# EAGLE design TikiLights (EAGLE 7.3.0)
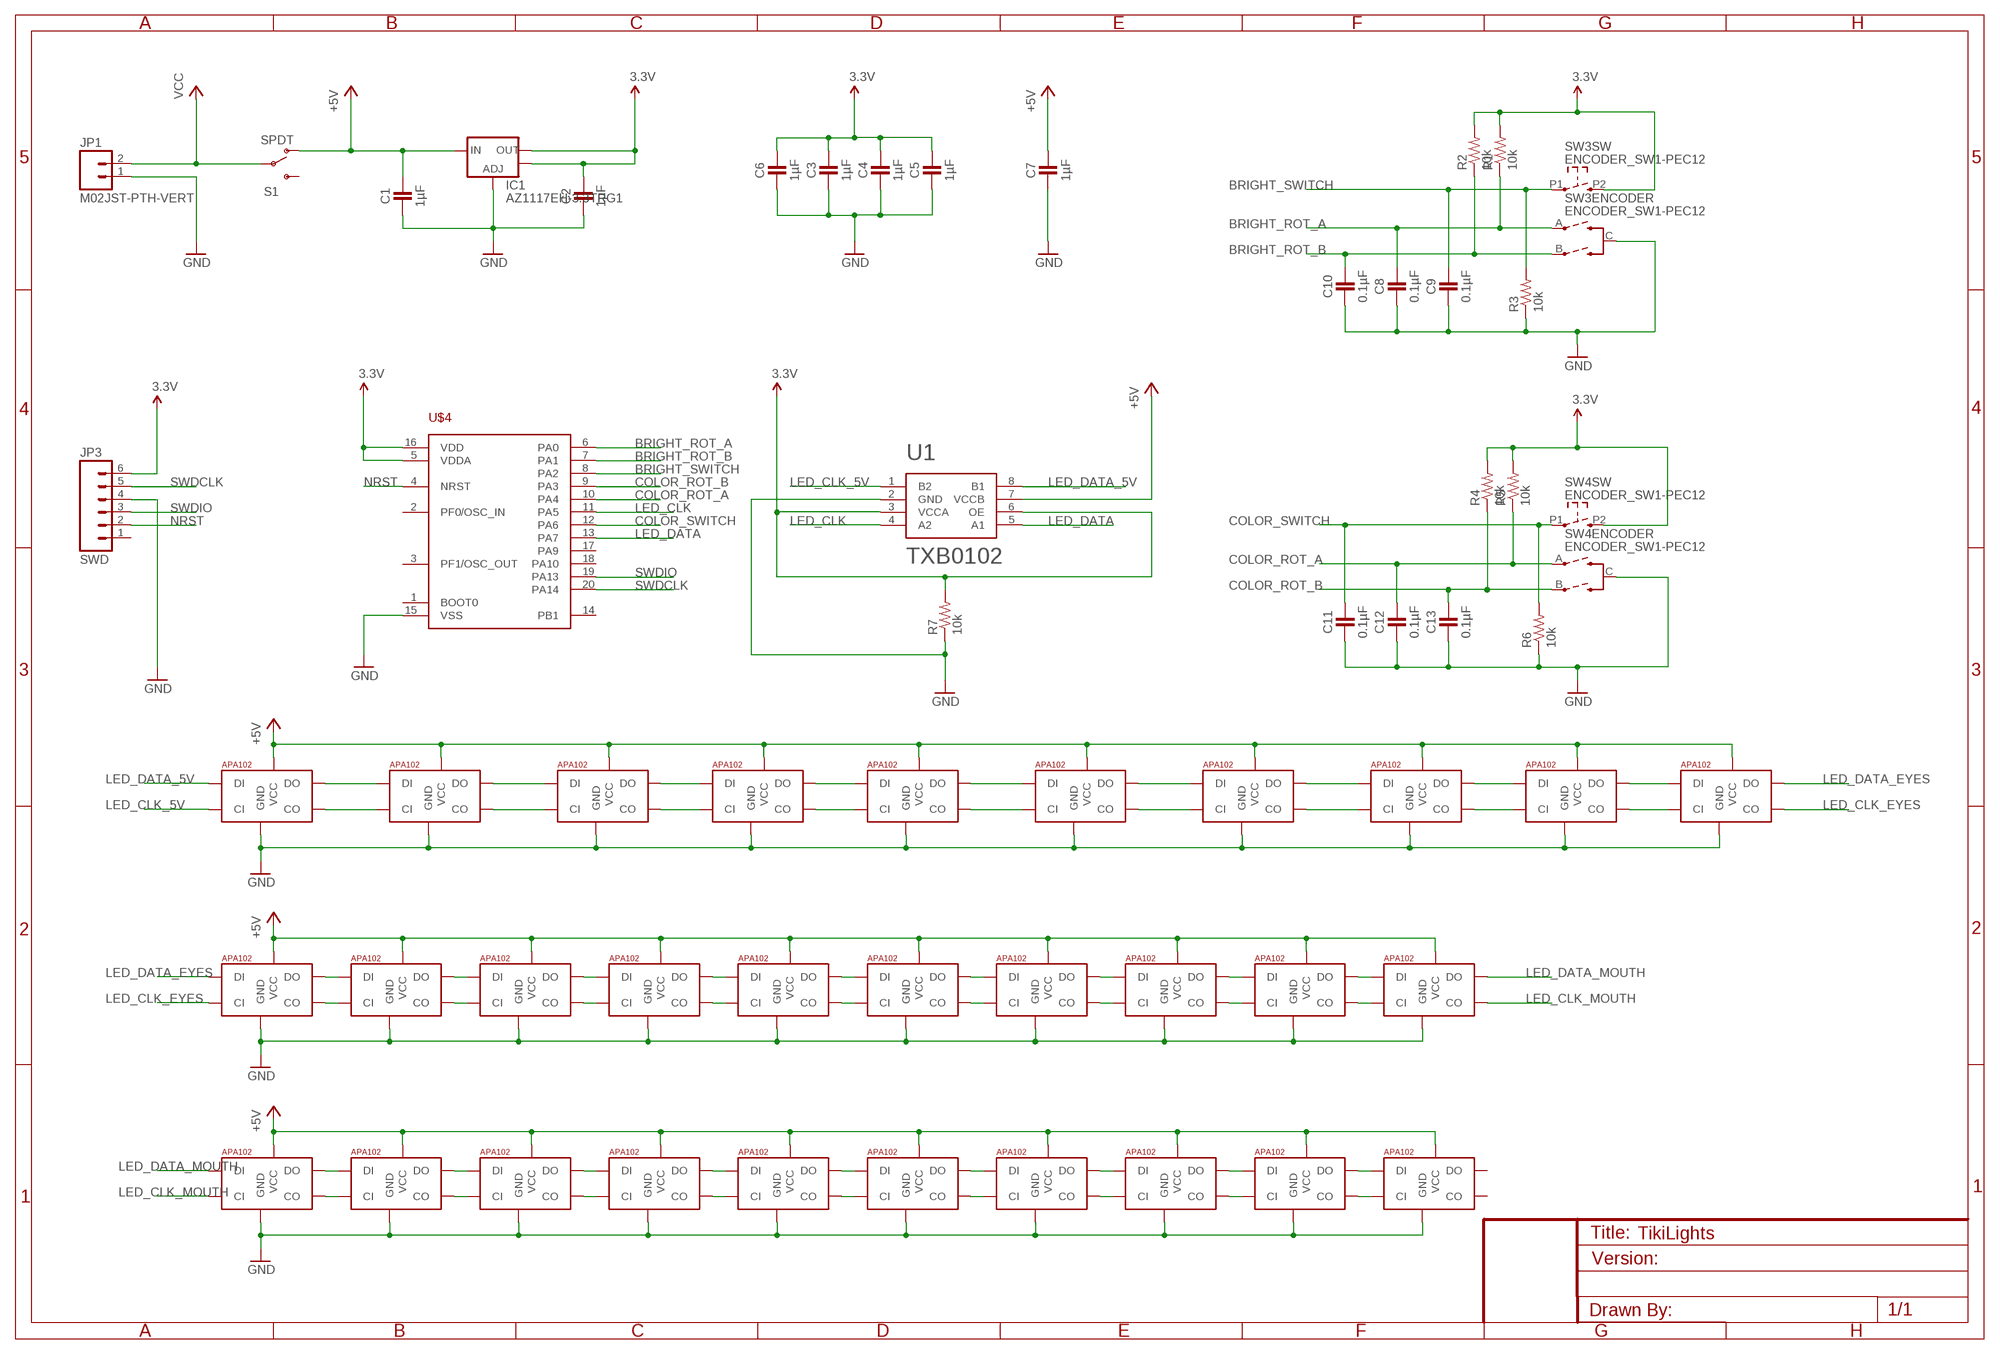
[diagram p0: schematic, sheet 1]

## Parts
C1  1µF  CAPACITOR0603_CAP  [0603_CAP]
C2  1µF  CAPACITOR0603_CAP  [0603_CAP]
C3  1µF  CAPACITOR0603_CAP  [0603_CAP]
C4  1µF  CAPACITOR0603_CAP  [0603_CAP]
C5  1µF  CAPACITOR0603_CAP  [0603_CAP]
C6  1µF  CAPACITOR0603_CAP  [0603_CAP]
C7  1µF  CAPACITOR0603_CAP  [0603_CAP]
C8  0.1µF  CAPACITOR0603_CAP  [0603_CAP]
C9  0.1µF  CAPACITOR0603_CAP  [0603_CAP]
C10  0.1µF  CAPACITOR0603_CAP  [0603_CAP]
C11  0.1µF  CAPACITOR0603_CAP  [0603_CAP]
C12  0.1µF  CAPACITOR0603_CAP  [0603_CAP]
C13  0.1µF  CAPACITOR0603_CAP  [0603_CAP]
IC1  AZ1117EH-3.3TRG1  V_REG_LM1117SOT223  [SOT223]
JP1  M02JST-PTH-VERT  [JST-2-PTH-VERT]
JP3  SWD  M06POLAR  [MOLEX-1X6]
R1  10k  RESISTOR0603  [0603-RES]
R2  10k  RESISTOR0603  [0603-RES]
R3  10k  RESISTOR0603  [0603-RES]
R4  10k  RESISTOR0603  [0603-RES]
R5  10k  RESISTOR0603  [0603-RES]
R6  10k  RESISTOR0603  [0603-RES]
R7  10k  RESISTOR0603  [0603-RES]
S1  SPDT  SWITCH-SPDTPTH  [SWITCH-SPDT]
SW3  ENCODER_SW1-PEC12  [PEC12_INCREMENTAL_ENCODER]
SW4  ENCODER_SW1-PEC12  [PEC12_INCREMENTAL_ENCODER]
U1  TXB0102  [SOP50P310X90-8N]
U$1  APA1022020  [APA102_2020]
U$2  APA1022020  [APA102_2020]
U$3  APA1022020  [APA102_2020]
U$4  STM32F030F4  [TSSOP20]
U$5  APA1022020  [APA102_2020]
U$6  APA1022020  [APA102_2020]
U$7  APA1025050  [APA102_5050]
U$8  APA1025050  [APA102_5050]
U$9  APA1025050  [APA102_5050]
U$10  APA1025050  [APA102_5050]
U$11  APA1025050  [APA102_5050]
U$12  APA1025050  [APA102_5050]
U$13  APA1025050  [APA102_5050]
U$14  APA1025050  [APA102_5050]
U$15  APA1025050  [APA102_5050]
U$16  APA1025050  [APA102_5050]
U$17  APA1025050  [APA102_5050]
U$18  APA1025050  [APA102_5050]
U$19  APA1025050  [APA102_5050]
U$20  APA1025050  [APA102_5050]
U$21  APA1025050  [APA102_5050]
U$22  APA1025050  [APA102_5050]
U$23  APA1025050  [APA102_5050]
U$24  APA1025050  [APA102_5050]
U$25  APA1025050  [APA102_5050]
U$26  APA1025050  [APA102_5050]
U$27  APA1022020  [APA102_2020]
U$28  APA1022020  [APA102_2020]
U$29  APA1022020  [APA102_2020]
U$30  APA1022020  [APA102_2020]
U$31  APA1022020  [APA102_2020]

## Nets
3.3V: C2.1 C3.1 C4.1 C5.1 C6.1 IC1.2(OUT) IC1.4(OUT) JP3.6 R1.2 R2.2 R4.2 R5.2 R7.2 SW3.P2 SW4.P2 U1.3(VCCA) U1.6(OE) U$4.5(VDDA) U$4.16(VDD)
+5V: C1.1 C7.1 IC1.3(IN) S1.1(O) U1.7(VCCB) U$1.V_CC(VCC) U$2.V_CC(VCC) U$3.V_CC(VCC) U$5.V_CC(VCC) U$6.V_CC(VCC) U$7.1(VCC) U$8.1(VCC) U$9.1(VCC) U$10.1(VCC) U$11.1(VCC) U$12.1(VCC) U$13.1(VCC) U$14.1(VCC) U$15.1(VCC) U$16.1(VCC) U$17.1(VCC) U$18.1(VCC) U$19.1(VCC) U$20.1(VCC) U$21.1(VCC) U$22.1(VCC) U$23.1(VCC) U$24.1(VCC) U$25.1(VCC) U$26.1(VCC) U$27.V_CC(VCC) U$28.V_CC(VCC) U$29.V_CC(VCC) U$30.V_CC(VCC) U$31.V_CC(VCC)
BRIGHT_ROT_A: C8.1 R1.1 SW3.A(ENCODER:A) U$4.6(PA0)
BRIGHT_ROT_B: C10.1 R2.1 SW3.B(ENCODER:B) U$4.7(PA1)
BRIGHT_SWITCH: C9.1 R3.2 SW3.P1 U$4.8(PA2)
COLOR_ROT_A: C12.1 R5.1 SW4.A(ENCODER:A) U$4.10(PA4)
COLOR_ROT_B: C13.1 R4.1 SW4.B(ENCODER:B) U$4.9(PA3)
COLOR_SWITCH: C11.1 R6.2 SW4.P1 U$4.12(PA6)
GND: C1.2 C2.2 C3.2 C4.2 C5.2 C6.2 C7.2 C8.2 C9.2 C10.2 C11.2 C12.2 C13.2 IC1.1(ADJ) JP1.1 JP3.4 R3.1 R6.1 R7.1 SW3.C(ENCODER:C) SW4.C(ENCODER:C) U1.2(GND) U$1.GND U$2.GND U$3.GND U$4.15(VSS) U$5.GND U$6.GND U$7.6(GND) U$8.6(GND) U$9.6(GND) U$10.6(GND) U$11.6(GND) U$12.6(GND) U$13.6(GND) U$14.6(GND) U$15.6(GND) U$16.6(GND) U$17.6(GND) U$18.6(GND) U$19.6(GND) U$20.6(GND) U$21.6(GND) U$22.6(GND) U$23.6(GND) U$24.6(GND) U$25.6(GND) U$26.6(GND) U$27.GND U$28.GND U$29.GND U$30.GND U$31.GND
LED_CLK: U1.4(A2) U$4.11(PA5)
LED_CLK_5V: U1.1(B2) U$1.C_IN(CI)
LED_CLK_EYES: U$7.5(CI) U$31.CL_OUT(CO)
LED_CLK_MOUTH: U$16.2(CO) U$17.5(CI)
LED_DATA: U1.5(A1) U$4.13(PA7)
LED_DATA_5V: U1.8(B1) U$1.D_IN(DI)
LED_DATA_EYES: U$7.4(DI) U$31.D_OUT(DO)
LED_DATA_MOUTH: U$16.3(DO) U$17.4(DI)
N$7: U$1.D_OUT(DO) U$2.D_IN(DI)
N$9: U$1.CL_OUT(CO) U$2.C_IN(CI)
N$14: U$2.D_OUT(DO) U$3.D_IN(DI)
N$15: U$2.CL_OUT(CO) U$3.C_IN(CI)
N$16: U$3.D_OUT(DO) U$5.D_IN(DI)
N$17: U$3.CL_OUT(CO) U$5.C_IN(CI)
N$18: U$5.D_OUT(DO) U$6.D_IN(DI)
N$19: U$5.CL_OUT(CO) U$6.C_IN(CI)
N$20: U$6.D_OUT(DO) U$27.D_IN(DI)
N$21: U$6.CL_OUT(CO) U$27.C_IN(CI)
N$22: U$27.D_OUT(DO) U$28.D_IN(DI)
N$23: U$27.CL_OUT(CO) U$28.C_IN(CI)
N$24: U$28.D_OUT(DO) U$29.D_IN(DI)
N$25: U$28.CL_OUT(CO) U$29.C_IN(CI)
N$26: U$29.D_OUT(DO) U$30.D_IN(DI)
N$27: U$29.CL_OUT(CO) U$30.C_IN(CI)
N$28: U$30.D_OUT(DO) U$31.D_IN(DI)
N$29: U$30.CL_OUT(CO) U$31.C_IN(CI)
N$34: U$7.2(CO) U$8.5(CI)
N$35: U$7.3(DO) U$8.4(DI)
N$36: U$8.3(DO) U$9.4(DI)
N$37: U$8.2(CO) U$9.5(CI)
N$38: U$9.3(DO) U$10.4(DI)
N$39: U$9.2(CO) U$10.5(CI)
N$40: U$10.3(DO) U$11.4(DI)
N$41: U$10.2(CO) U$11.5(CI)
N$42: U$11.3(DO) U$12.4(DI)
N$43: U$11.2(CO) U$12.5(CI)
N$44: U$12.3(DO) U$13.4(DI)
N$45: U$12.2(CO) U$13.5(CI)
N$46: U$13.3(DO) U$14.4(DI)
N$47: U$13.2(CO) U$14.5(CI)
N$48: U$14.3(DO) U$15.4(DI)
N$49: U$14.2(CO) U$15.5(CI)
N$50: U$15.2(CO) U$16.5(CI)
N$51: U$15.3(DO) U$16.4(DI)
N$56: U$17.3(DO) U$18.4(DI)
N$57: U$17.2(CO) U$18.5(CI)
N$58: U$18.3(DO) U$19.4(DI)
N$59: U$18.2(CO) U$19.5(CI)
N$60: U$19.3(DO) U$20.4(DI)
N$61: U$19.2(CO) U$20.5(CI)
N$62: U$20.3(DO) U$21.4(DI)
N$63: U$20.2(CO) U$21.5(CI)
N$64: U$21.3(DO) U$22.4(DI)
N$65: U$21.2(CO) U$22.5(CI)
N$66: U$22.3(DO) U$23.4(DI)
N$67: U$22.2(CO) U$23.5(CI)
N$68: U$23.3(DO) U$24.4(DI)
N$69: U$23.2(CO) U$24.5(CI)
N$70: U$24.3(DO) U$25.4(DI)
N$71: U$24.2(CO) U$25.5(CI)
N$72: U$25.3(DO) U$26.4(DI)
N$73: U$25.2(CO) U$26.5(CI)
NRST: JP3.2 U$4.4(NRST)
SWDCLK: JP3.5 U$4.20(PA14)
SWDIO: JP3.3 U$4.19(PA13)
VCC: JP1.2 S1.2(P)
Unconnected: JP3.1 S1.3(S) U$4.1(BOOT0) U$4.2(PF0/OSC_IN) U$4.3(PF1/OSC_OUT) U$4.14(PB1) U$4.17(PA9) U$4.18(PA10) U$26.2(CO) U$26.3(DO)

## Library data of the parts
C1-C13 = passives:CAPACITOR: 0402 Capacitor
IC1 = SparkFun-PowerIC:V_REG_LM1117: Voltage Regulator LM1117 Standard adjustable voltage regulator but in SMD form. Spark Fun Electronics SKU : COM-00595
JP1 = SparkFun-Connectors:M02: Standard 2-pin 0.1" header. Use with - straight break away headers ( PRT-00116) - right angle break away headers (PRT-00553) - swiss pins (PRT-00743) - machine pins (PRT-00117) - female headers (PRT-00115) Molex polarized connector foot print use with: PRT-08233 with associated crimp pins and housings. 2.54_SCREWTERM for use with PRT-10571. 3.5mm Screw Terminal footprints for PRT-08084 5mm Screw Terminal footprints for use with PRT-08433
JP3 = SparkFun-Connectors:M06: Header 6 Standard 6-pin 0.1" header. Use with straight break away headers (SKU : PRT-00116), right angle break away headers (PRT-00553), swiss pins (PRT-00743), machine pins (PRT-00117), and female headers (PRT-00115). Molex polarized connector foot print use with SKU : PRT-08094 with associated crimp pins and housings. NOTES ON THE VARIANTS LOCK and LOCK_LONGPADS... This footprint was designed to help hold the alignment of a through-hole component (i.e. 6-pin header) while soldering it into place. You may notice that each hole has been shifted either up or down by 0.005 of an inch from it's more standard position (which is a perfectly straight line). This slight alteration caused the pins (the squares in the middle) to touch the edges of the holes. Because they are alternating, it causes a "brace" to hold the component in place. 0.005 has proven to be the perfect amount of "off-center" position when using our standard breakaway headers. Although looks a little odd when you look at the bare footprint, once you have a header in there, the alteration is very hard to notice. Also,if you push a header all the way into place, it is covered up entirely on the bottom side. This idea of altering the position of holes to aid alignment will be further integrated into the Sparkfun Library for other footprints. It can help hold any component with 3 or more connection pins.
R1-R7 = SparkFun-Resistors:RESISTOR: Resistor Basic schematic elements and footprints for 0603, 1206, and PTH resistors.
S1 = SparkFun-Electromechanical:SWITCH-SPDT: SPDT Switch Simple slide switch, Spark Fun Electronics SKU : COM-00102 DPDT SMT slide switch, AYZ0202, SWCH-08179
SW3 SW4 = dp_devices.v6:ENCODER_SW1: Incremental Encoder with push switch
U1 = TXB0102:TXB0102; AVAILABILITY: Unavailable; DESCRIPTION: 2-Bit Bidirectional Voltage-Level Translator with Auto Direction Sensing and +/-15-kV ESD Protect; MF: Texas Instruments; MP: TXB0102; PACKAGE: None; PRICE: None
U$1-U$3 U$5-U$31 = jos-ph:APA102: APA102C 5050 RGB LED -- Adafruit DotStar Single LED Pixel Product Page: https://www.adafruit.com/products/2343 Datasheet: https://cdn-shop.adafruit.com/product-files/2343/APA102C.pdf
U$4 = stm32f030f4:STM32F030F4

## Board
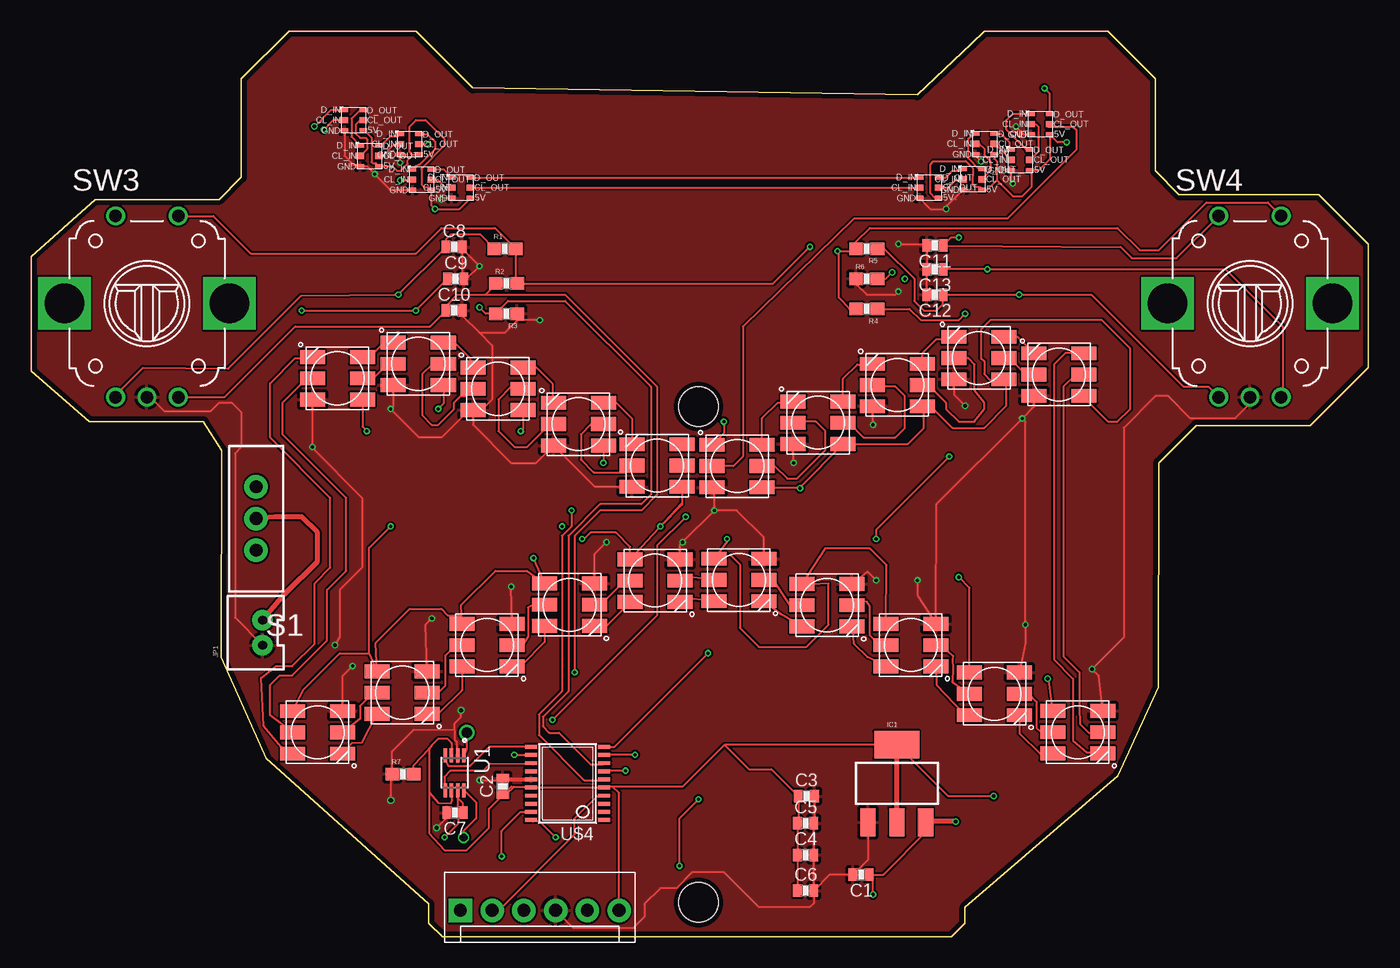
[diagram p1: board, top side]
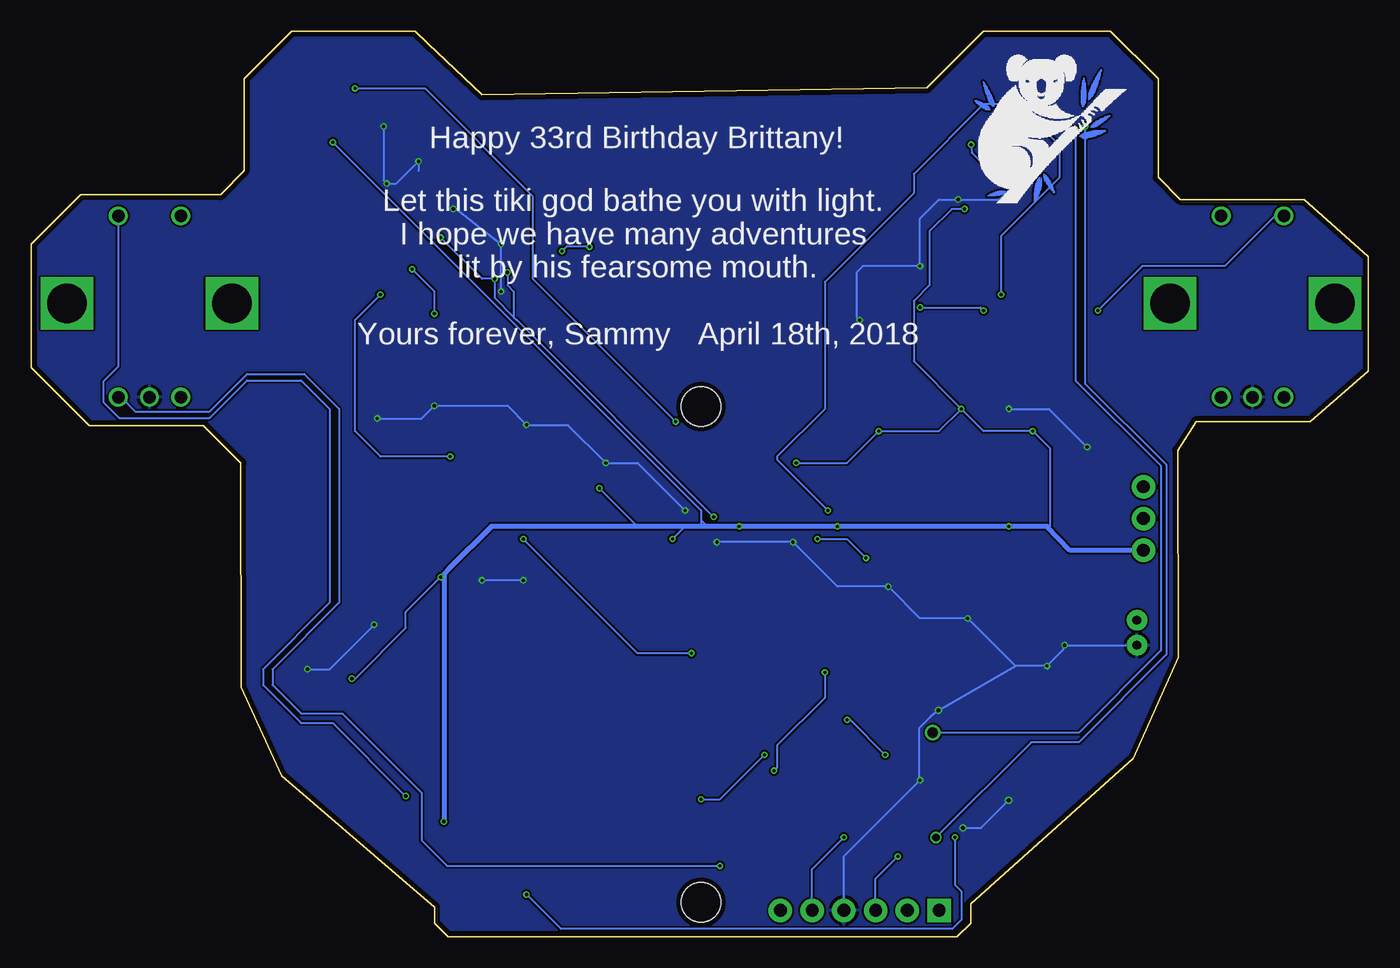
[diagram p2: board, bottom side, seen from below]

Size 106.98 x 72.47 mm. Coordinates in mm from the lower left corner, seen from the top.
Outline: 75.23,71.45 70.89,67.38 35.32,67.93 30.78,72.47 20.62,72.47 16.81,68.66 16.81,60.79 15.04,59.01 5.13,59.01 0,54.44 0,45.29 4.62,41.23 13.77,41.23 15.24,38.92 15.2,22.37 18.79,14.3 31.8,2.62 31.8,1.1 32.9,0 73.63,0 74.73,1.1 74.73,2.37 86.95,12.89 90.2,19.95 90.22,37.93 93.22,40.92 102.36,40.92 106.98,45.55 106.98,55.45 103.02,59.39 91.85,59.39 89.97,61.29 89.97,68.66 86.16,72.47 76.25,72.47 75.23,71.45
Copper layers (1*16): Top 0.035559375mm / dielectric 1.6mm / Bottom 0.035559375mm
Design rules "oshpark-2layer": minimum track width 6mil, minimum drill 10mil, track to track 6mil, track to pad 6mil, pad to pad 6mil, via to via 6mil, smd to smd 6mil, copper to edge 15mil, drill to drill 6mil, minimum pad ring 5mil, minimum via ring 5mil, stop-mask expansion 2.5mil, vias tented up to drill 0mil, thermal gap 10mil
Holes 3.17 mm at 53.39,2.75 53.39,42.43

### Footprints (pad centres in the part's own frame; a part is rotated, then mirrored left to right if it is on the bottom)
0603_CAP = smd 0.7 x 1: 1 -0.65,0; 2 0.65,0
SOT223 = smd 1.219 x 2.235: 1 -2.311,-3.099; 2 0,-3.099; 3 2.311,-3.099 | smd 3.6 x 2.2: 4 0,3.099
JST-2-PTH-VERT = drill 0.7 pad 1.626: 1 -1,-0.55; 2 1,-0.55
MOLEX-1X6 = drill 1.016 pad 1.88 square: 1 0,0 | drill 1.016 pad 1.88: 2 2.54,0; 3 5.08,0; 4 7.62,0; 5 10.16,0; 6 12.7,0
0603-RES = smd 1.1 x 1: 1 -0.85,0; 2 0.85,0
SWITCH-SPDT = drill 1.016 pad 1.88: 1 0,2.54; 2 0,0; 3 0,-2.54
PEC12_INCREMENTAL_ENCODER = drill 1: A -2.5,-7.5; B 2.5,-7.5; C 0,-7.5; P1 -2.5,7; P2 2.5,7 | drill 3.175 square: GND@1 -6.6,0; GND@2 6.6,0
SOP50P310X90-8N = smd 1.12 x 0.27: 1 -1.405,0.75; 2 -1.405,0.25; 3 -1.405,-0.25; 4 -1.405,-0.75; 5 1.405,-0.75; 6 1.405,-0.25; 7 1.405,0.25; 8 1.405,0.75
APA102_2020 = smd 0.6 x 0.5: C_IN 0.25,1; CL_OUT 1.75,1 | smd 0.6 x 0.35: D_IN 0.25,1.825; D_OUT 1.75,1.825; GND 0.25,0.175; V_CC 1.75,0.175
TSSOP20 = smd 0.305 x 0.991: 1 -2.925,-2.918; 2 -2.275,-2.918; 3 -1.625,-2.918; 4 -0.975,-2.918; 5 -0.325,-2.918; 6 0.325,-2.918; 7 0.975,-2.918; 8 1.625,-2.918; 9 2.275,-2.918; 10 2.925,-2.918; 11 2.925,2.918; 12 2.275,2.918; 13 1.625,2.918; 14 0.975,2.918; 15 0.325,2.918; 16 -0.325,2.918; 17 -0.975,2.918; 18 -1.625,2.918; 19 -2.275,2.918; 20 -2.925,2.918
APA102_5050 = smd 2 x 1.1: 1 2,-1.7; 2 2,0; 3 2,1.7; 4 -2,1.7; 5 -2,0; 6 -2,-1.7

### Placement (x,y rotation side)
C1  66.41,4.97 180 top
C2  37.72,12.04 90 top
C3  62.03,11.26 0 top
C4  61.96,6.56 0 top
C5  61.96,9.1 0 top
C6  61.96,3.7 0 top
C7  33.9,9.92 180 top
C8  33.83,55.2 0 top
C9  33.96,52.66 0 top
C10  33.83,50.12 0 top
C11  72.31,55.32 180 top
C12  72.31,51.39 180 top
C13  72.31,53.42 180 top
IC1  69.27,12.27 0 top
JP1  17.96,24.34 90 top
JP3  34.34,2.11 0 top
R1  37.9,55.07 0 top
R2  38.02,52.28 0 top
R3  38.02,49.86 180 top
R4  66.85,50.24 180 top
R5  66.85,55.07 180 top
R6  66.85,52.66 0 top
R7  29.74,13.03 0 top
S1  18,33.47 180 top
SW3  9.26,50.69 0 top
SW4  97.52,50.69 0 top
U1  33.87,13.12 270 top
U$1  24.82,64.34 0 top
U$2  26.09,61.48 0 top
U$3  29.27,62.42 0 top
U$4  42.91,12.27 90 top
U$5  30.25,59.59 0 top
U$6  33.39,58.94 0 top
U$7  56.49,37.67 0 top
U$8  62.97,41.14 0 top
U$9  69.3,44.16 0 top
U$10  75.84,46.32 0 top
U$11  82.23,45 0 top
U$12  83.74,16.37 180 top
U$13  77.08,19.45 180 top
U$14  70.38,23.35 180 top
U$15  63.68,26.53 180 top
U$16  56.62,28.55 180 top
U$17  49.92,28.5 180 top
U$18  43.08,26.57 180 top
U$19  36.46,23.35 180 top
U$20  29.69,19.54 180 top
U$21  22.91,16.36 180 top
U$22  24.5,44.69 0 top
U$23  30.98,45.85 0 top
U$24  37.35,43.86 0 top
U$25  43.79,41.02 0 top
U$26  50.09,37.71 0 top
U$27  70.85,58.94 0 top
U$28  74.33,59.62 0 top
U$29  75.31,62.45 0 top
U$30  78.16,61.17 0 top
U$31  79.74,64.02 0 top
U$32  [KOALA]  31.47,58.73 0 bottom
U$34  [CAD-DRAWING]  -0.9,-8.37 0 top  (outside the outline)

### Tracks (layer width: path | path; a pad name or v marks a point on that pad's centre or on a via)
3.3V  (via drill 0.25)
  Top 0.152: 55.47,15.37 IC1.4 73.38,11.26 v77.01,11.26 | 55.47,15.37 52.12,12.02 46.53,12.02 | 46.53,12.02 45.9,12.02 U$4.5 U$4.16 39.92,12.02 38.63,12.02 | 31.85,11.56 31.85,8.28 33.07,6.94 34.85,6.94 36.63,8.72 36.63,10.24 38.4,12.02 38.63,12.02 | JP3.6 47.04,11.51 46.53,12.02 | SW4.P2 98.96,58.76 94.03,58.76 90.22,54.94 88.7,54.94 86.92,56.72 67.11,56.72 66,55.62 R5.2 65.8,54.87 v64.52,54.87 64.62,54.77 64.62,51.13 65.51,50.24 R4.2 65.46,50.24 | SW3.P2 14.58,57.69 17.58,54.69 30.78,54.69 32.82,56.72 37.1,56.72 R1.2 38.75,52.4 R2.2 59.36,52.28 v62.31,55.22 | C6.1 C4.1 C5.1 61.38,9.16 C3.1 59.22,13.41 57.43,13.41 55.47,15.37 | U1.3 33.62,15.51 33.65,15.51 33.32,15.83 32.56,15.83 32.05,15.32 31.83,15.04 | 31.83,15.04 31.85,11.56 | 31.85,11.56 32.56,10.72 33.58,10.7 33.68,10.93 33.68,11.66 U1.6 | C2.1 38.01,11.39 38.63,12.02 | R7.2 30.59,13.71 31.83,15.04
  Top 0.406: IC1.2 IC1.4
  Bottom 0.152: SW4.P2 100.02,45.65 101.22,44.45 101.22,42.81 99.94,41.53 92.71,41.53 89.71,44.53 85.39,44.53 83.11,42.24 83.11,26.75 88.44,21.42 88.44,20.15 85.39,17.1 82.85,17.1 v77.01,11.26 | v62.31,55.22 64.16,55.22 v64.52,54.87
+5V  (via drill 0.25)
  Top 0.152: U$1.V_CC 26.67,64.52 27.23,63.96 27.23,62 27.3,61.93 27.57,61.93 U$2.V_CC 28.9,61.66 29.26,61.29 29.57,61.29 30.12,61.85 30.12,62.16 30.53,62.56 | U$6.V_CC 34.26,58.25 v32.31,58.25 32,58.55 U$5.V_CC 31.77,60 31.44,60 31.24,60.2 31.22,61.47 33.05,63.3 33.07,63.83 31.55,65.36 30.78,65.36 30.28,64.85 30.28,62.82 30.53,62.56 | 30.53,62.56 31.04,62.56 31.04,62.58 U$3.V_CC | U$27.V_CC 72.33,59.12 71.93,59.52 71.93,61.8 72.19,62.06 74.78,62.08 75.34,61.52 75.31,60.2 75.49,60.02 75.85,60.02 U$28.V_CC 76.53,59.79 77.27,60.53 | U$29.V_CC 77.06,62.26 77.27,62.06 77.27,60.53 | 77.27,60.53 78.54,59.26 79.3,59.26 80.06,60.02 80.06,61.19 U$30.V_CC 79.95,61.29 80.57,61.29 81.49,62.22 U$31.V_CC 82.11,63.58 v82.85,63.58 | C7.1 34.55,10.69 34.09,11.15 34.09,11.84 U1.7 34.15,9.03 v33.07,7.95 | v61.52,35.89 61.44,35.97 U$7.1 61.5,35.97 U$8.1 70.14,39.44 71.42,40.72 71.42,42.34 U$9.1 71.97,42.46 73.71,40.72 76.25,40.72 78.03,42.5 78.03,44.44 U$10.1 77.75,44.53 76.76,44.53 76.25,45.04 76.25,46.05 76,46.31 76,48.59 76.76,49.36 85.65,49.36 87.93,47.07 87.93,42.24 86.92,41.23 86.16,41.23 84.23,43.15 U$11.1 | U$12.1 81.44,20.55 v81.33,20.65 | U$13.1 75.08,27.92 v74.22,28.78 | U$14.1 68.43,29.74 67.11,31.07 63.52,31.07 U$15.1 61.95,28.35 62.46,28.2 63.8,28.27 63.8,24.97 62.03,23.19 58.22,23.19 56.69,24.72 56.69,29.8 55.93,30.56 U$16.1 55.68,31.62 v55.68,31.83 | U$21.1 21.79,19.79 24.69,22.69 27.03,22.69 | 27.03,22.69 U$20.1 27.57,23.53 30.28,26.24 32.82,26.24 33.32,25.73 34.29,25.73 U$19.1 34.41,26.57 37.13,29.29 39.66,29.29 U$18.1 40.18,30.23 v40.18,30.31
  Top 0.152: U$23.1 32.97,42.66 v32.56,42.24 | U$22.1 26.5,40.81 v26.85,40.47 | U$24.1 39.35,40.65 v39.17,40.47 | U$25.1 45.79,37.94 v45.77,37.93 | U$26.1 52.09,34.7 | 52.09,34.7 U$17.1 47.92,31.2 46.79,32.34 44.75,32.34 44.25,31.83 v44.08,31.83 | 52.09,34.7 52.09,34.59 v50.34,32.85 | 27.03,22.69 27.03,31.13 v28.75,32.85 | IC1.3 71.68,9.07 71.68,8.46 68.19,4.97 C1.1 67.36,4.67 v67.36,3.38
  Top 0.406: v73.96,9.22 71.63,9.22 IC1.3
  Bottom 0.152: v82.85,63.58 53.39,34.12 53.39,33.35 | 55.17,32.83 54.68,32.83 v55.68,31.83 | 55.17,32.83 58.45,32.83 v61.52,35.89 | v81.33,20.65 81.08,20.65 77.01,24.72 77.01,25.99 v74.22,28.78 | v74.22,28.78 73.96,29.04 | v74.22,28.78 73.58,29.42 | v32.56,42.24 30.78,40.47 v26.85,40.47 25.45,39.07 25.45,32.85 25.96,32.85 | v32.56,42.24 34.34,40.47 v39.17,40.47 41.71,37.93 v45.77,37.93 | v32.31,58.25 33.32,58.25 35.1,56.47 35.1,52.15 36.37,50.88 36.37,46.05 v32.56,42.24 | 53.39,33.35 52.88,32.85 | v44.08,31.83 41.71,31.83 v40.18,30.31 | v33.07,7.95 33.07,4.14 32.56,3.64 32.56,1.35 33.29,0.63 64.61,0.63 v67.36,3.38 | 53.39,33.35 53.39,32.85 55.15,32.85 55.17,32.83
  Bottom 0.406: S1.1 23.86,30.93 25.7,32.85 25.96,32.85 v28.75,32.85 v42.47,32.85 v50.34,32.85 52.88,32.85 53.39,32.85 70.15,32.85 73.58,29.42 73.96,29.04 v73.96,9.22
BRIGHT_ROT_A  (via drill 0.25)
  Top 0.152: SW3.A 6.76,43.36 8.94,45.55 15.77,45.47 21.62,51.31 v29.37,51.39 C8.1 33.18,55.82 33.58,56.21 35.9,56.21 R1.1 | v43.23,34.12 43.23,32.85 42.47,32.08 42.47,19.64 40.61,17.78 40.61,16.16 44.25,12.53 45.76,12.53 U$4.6
  Bottom 0.152: v29.37,51.39 29.37,56.1 24.69,60.79 24.69,63.33 27.99,66.63 30.78,66.63 36.37,61.04 36.37,59.52 43.48,52.4 43.48,42.24 47.29,38.43 47.29,38.18 v43.23,34.12
BRIGHT_ROT_B  (via drill 0.25)
  Top 0.152: SW3.B 15.47,43.19 21.13,48.85 31.91,48.85 C10.1 33.18,50.48 34.09,51.39 36.37,51.39 | 36.37,51.39 42.72,51.39 50.09,44.02 50.09,35.39 48.82,34.12 45.52,34.12 43.48,32.08 v43.48,21.16 | v47.55,13.29 45.87,13.29 U$4.7 | R2.1 37.17,52.19 36.37,51.39
  Bottom 0.152: v43.48,21.16 43.48,19.13 47.29,15.32 47.29,13.54 v47.55,13.29
BRIGHT_SWITCH  (via drill 0.25)
  Top 0.152: v21.64,50.12 v30.77,50.12 C9.1 | U$4.8 45.73,13.8 44.75,13.8 42.21,16.34 41.45,16.34 40.94,16.84 40.94,17.61 42.98,19.64 42.98,32.08 45.52,34.62 48.82,34.62 49.58,35.39 49.58,44.02 42.72,50.88 38.15,50.88 37.17,49.9 R3.2 36.37,49.86 v35.86,50.37
  Bottom 0.152: SW3.P1 7.47,57.69 11.48,53.67 18.08,53.67 v21.64,50.12 | v35.86,50.37 31.02,50.37 v30.77,50.12
COLOR_ROT_A  (via drill 0.25)
  Top 0.152: SW4.A 94.19,44.02 92.2,44.02 84.84,51.39 v79.04,51.39 C12.1 72.95,51.37 72.95,50.63 72.44,50.12 71.42,50.12 70.66,50.88 70.66,52.66 68.25,55.07 R5.1 | U$4.10 46.66,15.2 v54.15,22.69 | v67.61,31.83 67.61,32.59 v73.46,38.43
  Bottom 0.152: v54.15,22.69 58.47,22.69 v67.61,31.83 | v73.46,38.43 79.04,38.43 81.08,40.47 81.08,49.36 v79.04,51.39
COLOR_ROT_B  (via drill 0.25)
  Top 0.152: v51.87,5.67 51.87,9.48 v53.39,11 | v48.31,14.56 45.84,14.56 U$4.9 | SW4.B 100.13,43.29 100.13,48.85 95.55,53.42 v76.5,53.42 C13.1 | R4.1 70.28,50.24 71.17,49.36 74.22,49.36 v74.73,49.86
  Bottom 0.152: SW4.B 99.8,43.19 98.65,42.03 92.72,42.03 89.71,45.04 85.14,45.04 82.35,42.24 82.35,26.75 87.68,21.42 87.68,20.15 85.39,17.86 82.09,17.86 75.74,11.51 75.74,7.7 73.71,5.67 v51.87,5.67 | v53.39,11 51.87,11 v48.31,14.56 | v74.73,49.86 74.73,51.64 v76.5,53.42
COLOR_SWITCH  (via drill 0.25)
  Top 0.152: SW4.P1 91.64,54.31 88.06,54.31 87.17,55.2 C11.1 73.6,55.96 v74.22,55.96 | v52.37,33.61 50.09,31.32 50.09,25.73 v41.71,17.35 | v38.66,14.56 39.98,14.56 U$4.12 | R6.2 68.38,52.66 v68.88,53.17
  Bottom 0.152: v74.22,55.96 70.92,52.66 v69.9,52.66 69.9,51.13 68.38,49.61 | v52.37,33.61 68.12,49.36 68.38,49.61 | v41.71,17.35 41.45,17.35 v38.66,14.56 | v68.88,53.17 68.88,52.15 68.38,51.64 68.38,49.61
GND  (via drill 0.25, 0.25 pad 0.25, 0.33)
  Top 0.152: U$1.GND 25.07,62.5 25.77,61.8 26.19,61.8 U$2.GND 26.86,61.66 v27.48,61.04 28.76,59.77 U$5.GND | v29.51,61.95 29.51,62.59 U$3.GND | U$6.GND 32.93,59.12 v32.82,59.01 | U$29.GND 75.56,62.49 v76,62.06 | 73.96,59.01 73.96,59.17 U$28.GND 73.2,58.41 v73.2,58.25 71.93,58.25 71.1,59.08 U$27.GND | U$30.GND 78.41,60.41 v78.54,60.28 | U$31.GND 79.44,64.2 v78.79,64.85 | U$8.6 60.97,37.97 v61.01,37.93 | v54.66,34.12 54.66,35.8 U$7.6 | U$9.6 67.3,41.03 v67.36,40.97 | U$10.6 73.84,43.38 v74.73,42.5 | U$11.6 80.23,42.42 v79.3,41.48 | U$12.6 85.44,20.86 v84.89,21.42 87.43,23.96 87.43,40.72 89.97,43.26 90.98,43.26 92.76,41.48 96.32,41.48 97.52,42.69 SW4.C | U$13.6 79.55,23.53 v79.55,24.97 79.55,41.23 v79.3,41.48 | v79.3,41.48 72.43,34.62 U$14.6 70.92,27.3 v70.92,28.53 | U$15.6 66.92,29.22 v67.61,28.53 | U$16.6 58.62,31.94 56.44,34.12 v54.66,34.12 | U$17.6 51.92,31.38 v52.12,31.58 v54.66,34.12 | U$18.6 45.08,30.63 v46.02,31.58 | U$19.6 v38.41,28.01 v38.4,28.02 | U$20.6 31.57,24.99 v32.05,25.48 | U$21.6 24.91,20.88 v25.7,21.67 | v24.29,23.34 24.69,23.99 24.69,27.77 26.47,29.54 26.47,35.13 22.5,39.1 v22.5,39.2 U$22.6 | U$23.6 28.97,42.47 v28.75,42.24 31.04,39.96 32.82,39.96 35.02,42.16 U$24.6 | U$24.6 35.35,40.98 38.4,37.93 40.39,37.93 U$25.6 45.1,36.01 U$26.6 | v35.86,12.53 39.92,12.53 U$4.15 39.9,12.69 C2.2 | C12.2 C13.2 C11.2 71.54,55.45 v69.39,55.45 | R6.1 66,52.24 66.85,51.39 69.14,51.39 v69.39,51.64 | SW3.C 9.52,43.19 10.62,42.09 14.37,42.09 15.04,42.75 16.05,42.75 16.81,41.99 16.81,39.2 16.31,38.69 16.31,25.54 JP1.1 | C10.2 34.48,49.72 35.86,48.34 | 35.86,48.34 37.9,48.34 38.91,49.36
  Top 0.152: 38.91,49.36 38.91,49.82 R3.1 | 35.86,48.34 36.88,47.32 36.88,43.01 36.12,42.24 35.44,42.24 U$24.6 | v40.69,49.36 38.91,49.36 | C3.2 62.68,9.16 C5.2 C4.2 C6.2 | JP3.4 43.38,0.69 48.16,0.69 49.07,1.6 49.07,2.62 50.34,3.89 51.61,3.89 52.88,5.16 55.42,5.16 58.22,2.37 62.28,2.37 62.61,2.7 C6.2 | IC1.1 66.95,6.17 C1.2 63.88,4.97 C6.2 | 34.14,14.53 U1.2 34.04,14.61 34.04,15.62 33.88,15.78 33.88,16.51 | C7.2 33.25,9.53 v32.44,8.72 | v28.78,10.93 28.78,12.92 R7.1 28.89,14.83 30.58,16.54 33.88,16.51 | 33.88,16.51 33.88,17.07 34.39,17.58 v34.39,18.11 | C8.2 34.48,52.78 C9.2 34.85,52.66 v35.86,53.67 34.48,55.06 C8.2
  Bottom 0.152: v29.51,61.95 28.5,61.04 v27.48,61.04 29.51,59.01 v32.82,59.01 34.34,59.01 35.86,57.48 v35.86,53.67 40.44,53.67 40.94,53.17 40.94,49.61 v40.69,49.36 | 76,61.29 v76,62.06 77.77,60.28 v78.54,60.28 78.79,60.53 v78.79,64.85 | v54.66,34.12 58.47,37.93 v61.01,37.93 64.06,40.97 v67.36,40.97 68.88,42.5 v74.73,42.5 75.74,41.48 v79.3,41.48 | v84.89,21.42 83.11,21.42 v79.55,24.97 | v67.61,28.53 v70.92,28.53 | v52.12,31.58 v46.02,31.58 42.47,28.02 v38.4,28.02 35.86,25.48 v32.05,25.48 28.24,21.67 | 28.24,21.67 v25.7,21.67 24.43,22.94 v24.29,23.34 JP1.1 | v28.75,42.24 25.55,42.24 v22.5,39.2 | JP3.4 41.96,6.43 v35.86,12.53 35.94,12.6 35.94,16.67 35.03,17.58 v34.39,18.11 28.24,21.67 | v69.39,51.64 v69.39,55.45 72.95,58.25 v73.2,58.25 | v32.44,8.72 30.99,8.72 v28.78,10.93
  pour Top: -8.08,87.46 112.57,87.46 112.57,-3.73 -8.33,-3.73 -8.33,84.92
  pour Bottom: -9.35,88.47 114.1,88.47 114.1,-5 -9.6,-5 -9.6,87.96
LED_CLK
  Top 0.152: U$4.11 36.63,15.2 35.08,13.64 33.38,13.64 33.07,14.3 33.07,14.73 U1.4
LED_CLK_5V  (via drill 0.25, 0.81)
  Top 0.152: U$1.C_IN 24.16,65.34 v23.42,64.6 | v34.85,16.34 34.85,15 U1.1
  Bottom 0.152: v23.42,64.6 23.42,44.53 16.59,37.7 16.59,22.91 23.16,16.34 v34.85,16.34
LED_CLK_EYES
  Top 0.152: U$31.CL_OUT 81.33,64.85 83.36,64.85 83.62,64.6 83.62,62.98 78.12,57.48 65.84,57.48 56.95,48.85 56.95,38.43 56.18,37.67 U$7.5
LED_CLK_MOUTH
  Top 0.152: U$16.2 51.95,28.86 U$17.5
LED_DATA
  Top 0.152: U$4.13 40.08,13.9 40.18,13.8 36.73,13.85 36.14,13.26 33.53,13.26 33.07,12.78 33.07,11.98 U1.5
LED_DATA_5V  (via drill 0.25, 0.61)
  Top 0.152: U1.8 34.65,11.71 35.61,10.75 35.61,9.48 34.59,8.46 v34.59,7.95 | U$1.D_IN 23.97,66.17 v22.66,64.85
  Bottom 0.152: v22.66,64.85 22.66,44.28 16.16,37.78 16.16,22.58 23.16,15.57 26.97,15.57 v34.59,7.95
LED_DATA_EYES  (via drill 0.25)
  Top 0.152: U$31.D_OUT 81.49,67.48 v81.08,67.9 | v55.42,41.23 55.42,40.3 U$7.4
  Bottom 0.152: v81.08,67.9 75.49,67.9 66.85,59.26 66.85,52.66 v55.42,41.23
LED_DATA_MOUTH
  Top 0.152: U$16.3 51.95,27.16 U$17.4
N$7
  Top 0.152: U$1.D_OUT 26.32,66.17 25.63,65.47 25.63,64.01 U$2.D_IN
N$9
  Top 0.152: U$1.CL_OUT 26.32,65.34 25.97,64.99 25.97,64.28 26.31,63.94 26.75,63.94 26.87,63.81 26.87,63.02 U$2.C_IN
N$14
  Top 0.152: U$2.D_OUT 27.97,63.31 28.75,64.09 29.36,64.09 U$3.D_IN
N$15
  Top 0.152: U$2.CL_OUT 28.11,62.48 29.01,63.38 29.48,63.38 U$3.C_IN
N$16
  Top 0.152: U$3.D_OUT 31.69,64.25 32.3,63.64 32.3,63.04 31.06,61.8 30.76,61.67 U$5.D_IN
N$17  (via drill 0.25)
  Top 0.152: U$3.CL_OUT 31.7,63.42 v31.78,63.4 | v29.51,60.53 30.44,60.53 U$5.C_IN
  Bottom 0.152: v31.78,63.4 31.72,62.74 v29.51,60.53
N$18
  Top 0.152: U$5.D_OUT 32.99,61.42 U$6.D_IN
N$19
  Top 0.152: U$6.C_IN 33.15,59.94 32.56,60.53 32.06,60.53 U$5.CL_OUT
N$20
  Top 0.152: U$6.D_OUT U$27.D_IN
N$21
  Top 0.152: U$6.CL_OUT U$27.C_IN
N$22
  Top 0.152: U$27.D_OUT 73.19,60.77 73.71,61.29 74.43,61.29 U$28.D_IN
N$23
  Top 0.152: U$27.CL_OUT 73.38,59.94 73.96,60.53 74.5,60.53 U$28.C_IN
N$24
  Top 0.152: U$28.D_OUT 75.85,61.44 74.98,62.31 74.98,63.9 U$29.D_IN
N$25
  Top 0.152: U$29.C_IN 75.87,63.45 76.25,63.07 76.25,62.56 76.76,62.06 76.76,61.29 U$28.CL_OUT
N$26
  Top 0.152: U$29.D_OUT 77.59,64.27 78.28,63.58 78.28,63.11 U$30.D_IN
N$27
  Top 0.152: U$29.CL_OUT 77.14,63.45 77.77,62.82 77.77,62.8 U$30.C_IN
N$28
  Top 0.152: U$30.D_OUT 79.63,62.99 78.03,64.6 78.03,65.36 78.54,65.87 79.98,65.87 U$31.D_IN
N$29
  Top 0.152: U$31.C_IN 80.39,65.02 80.57,64.85 80.57,62.83 U$30.CL_OUT
N$34
  Top 0.152: U$7.2 59.49,37.67 60.5,36.66 61.26,36.66 63.55,38.94 63.55,40.47 62.79,41.23 61.06,41.23 U$8.5
N$35
  Top 0.152: U$7.3 58.49,41.5 59.74,42.75 60.88,42.75 U$8.4
N$36
  Top 0.152: U$8.3 64.97,44.68 66.09,45.8 67.24,45.8 U$9.4
N$37
  Top 0.152: U$8.2 65.42,41.14 66.6,39.96 69.14,39.96 69.9,40.72 69.9,43.26 69.14,44.02 67.44,44.02 U$9.5
N$38
  Top 0.152: U$9.3 71.3,46.69 72.44,47.83 73.66,47.83 U$10.4
N$39
  Top 0.152: U$9.2 71.79,44.16 73.2,42.75 73.2,42.24 74.22,41.23 75.49,41.23 76.25,42.24 76.25,42.75 75.49,43.77 75.49,45.8 74.98,46.31 73.86,46.31 U$10.5
N$40
  Top 0.152: U$10.3 78.91,48.02 U$11.4
N$41
  Top 0.152: U$10.2 78.27,46.32 79.55,45.04 80.19,45.04 U$11.5
N$42
  Top 0.152: U$11.3 82.74,46.7 81.84,45.8 81.84,22.18 83.36,20.65 83.36,15.73 84.45,14.76 85.37,14.76 U$12.4
N$43
  Top 0.152: U$11.2 83.58,45 82.6,44.02 82.6,22.43 83.87,21.16 83.87,18.37 83.92,17.02 84.64,16.31 U$12.5
N$44
  Top 0.152: U$13.4 79.08,16.28 80.77,14.58 81.65,14.58 U$12.3
N$45
  Top 0.152: U$13.5 79.84,19.45 80.44,18.8 80.44,16.72 80.85,16.36 81.55,16.36 U$12.2
N$46
  Top 0.152: U$14.4 72.43,20.15 74.57,17.86 75.09,17.83 U$13.3
N$47
  Top 0.152: U$14.5 73,23.14 73.76,22.48 73.71,22.15 73.76,21.52 73.69,20.4 U$13.2
N$48
  Top 0.152: U$14.3 66.9,22.38 65.84,23.45 65.76,24.62 U$15.4
N$49
  Top 0.152: U$14.2 67.74,23.5 67.11,24.13 67.11,26.5 66.88,26.8 65.74,26.9 U$15.5
N$50
  Top 0.152: U$15.2 60.72,26.56 59.23,28.78 58.69,28.78 U$16.5
N$51
  Top 0.152: U$15.3 59.95,25.82 U$16.4
N$56
  Top 0.152: U$17.3 47.92,26.77 46.02,24.87 U$18.4
N$57
  Top 0.152: U$18.5 45.57,26.57 47.04,28.04 47.47,28.04 U$17.2
N$58
  Top 0.152: U$18.3 41.08,23.58 39.29,21.77 37.8,21.77 U$19.4
N$59
  Top 0.152: U$18.2 39.98,26.5 39.75,26.34 39.75,24.03 39.22,23.17 38.59,23.75 U$19.5
N$60
  Top 0.152: U$19.3 34.46,19.73 32.59,17.86 31.72,17.86 U$20.4
N$61
  Top 0.152: U$20.5 32.56,19.54 33.15,20.12 33.15,22.53 33.88,23.27 34.39,23.27 U$19.2
N$62
  Top 0.152: U$20.3 27.57,17.69 26.44,15.52 25.62,15.47 U$21.4
N$63
  Top 0.152: U$20.2 27.38,19.56 26.36,18.52 26.31,18.44 26.3,17.43 25.77,17 U$21.5
N$64
  Top 0.152: U$21.3 20.01,15.19 18.59,16.87 18.39,20.73 19.61,21.67 20.88,21.67 22.66,23.45 22.66,28.27 23.93,29.54 23.93,35.13 19.1,39.96 19.1,44.28 21.13,46.31 22.41,46.31 U$22.4
N$65
  Top 0.152: U$21.2 19.13,17.71 19.1,18.62 19.1,20.15 19.86,20.91 20.88,20.91 23.67,23.7 23.67,27.77 25.2,29.29 25.2,35.13 20.12,40.21 20.12,42.75 21.89,44.53 22.33,44.53 U$22.5
N$66
  Top 0.152: U$22.3 27.06,46.39 27.99,47.32 28.75,47.32 U$23.4
N$67
  Top 0.152: U$22.2 27.39,44.69 28.5,45.8 28.92,45.8 U$23.5
N$68
  Top 0.152: U$23.3 33.86,47.55 35.1,46.31 35.1,45.8 U$24.4
N$69
  Top 0.152: U$23.2 32.11,45.85 31.29,45.04 31.29,41.74 32.05,40.97 32.56,40.97 33.83,42.24 33.83,42.75 34.34,43.26 34.75,43.26 U$24.5
N$70
  Top 0.152: U$24.3 40.43,45.56 41.71,44.28 41.71,42.81 U$25.4
N$71
  Top 0.152: U$24.2 39.35,43.95 39.42,44.02 38.4,44.02 37.39,43.01 37.39,40.47 38.66,39.2 39.67,39.2 41.2,40.72 41.48,40.72 U$25.5
N$72
  Top 0.152: U$25.3 46.81,42.72 48.06,41.48 48.06,39.44 U$26.4
N$73
  Top 0.152: U$25.2 44.81,41.02 43.99,40.21 43.99,38.18 45.01,37.16 47.54,37.16 U$26.5
NRST
  Top 0.152: JP3.2 37.39,2.09 43.48,8.21 43.48,9.48 45.26,11.26 45.79,11.26 U$4.4
SWDCLK  (via drill 0.25)
  Top 0.152: v41.96,7.95 40.69,9.22 40.12,9.22 U$4.20
  Bottom 0.152: JP3.5 44.5,5.41 v41.96,7.95
SWDIO  (via drill 0.25)
  Top 0.152: v37.64,6.43 37.64,8.46 39.17,9.99 U$4.19
  Bottom 0.152: JP3.3 39.42,4.65 v37.64,6.43
VCC
  Top 0.406: JP1.2 20.29,27.43 22.91,30.05 22.91,32.34 21.64,33.61 19.48,33.61 S1.2

### Text on the board
bPlace: Happy 33rd Birthday Brittany! | Let this tiki god bathe you with light. / I hope we have many adventures / lit by his fearsome mouth. / / Yours forever, Sammy April 18th, 2018